# Altium schematic sheet Sheet2.SchDoc
size A4
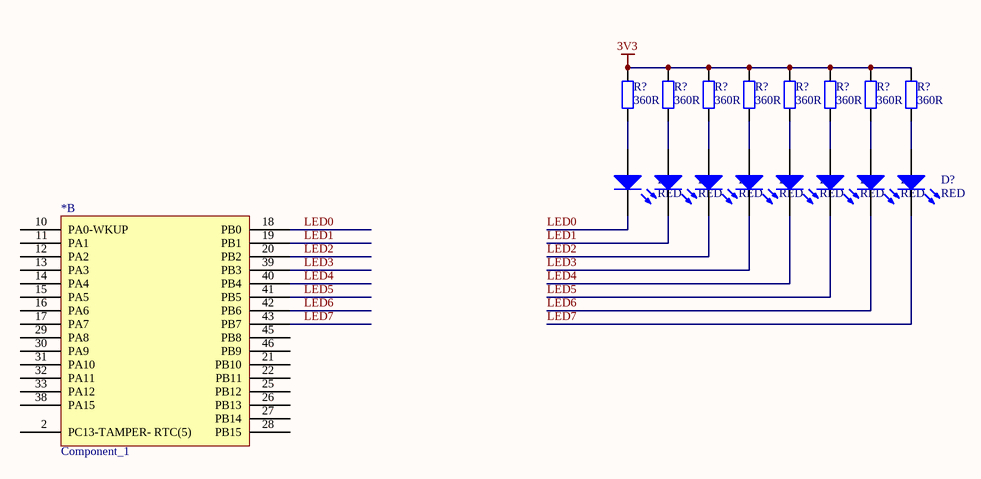
[diagram p0: Sheet2.SchDoc]

## Parts
(Parts that share a designator on the sheet are numbered #1, #2 ... from top to bottom, then left to right.)
*  Component_1  (part B of 2)
D?#1  RED  [LED-0]
D?#2  RED  [LED-0]
D?#3  RED  [LED-0]
D?#4  RED  [LED-0]
D?#5  RED  [LED-0]
D?#6  RED  [LED-0]
D?#7  RED  [LED-0]
D?#8  RED  [LED-0]
R?#1  360R  [AXIAL-0.4]
R?#2  360R  [AXIAL-0.4]
R?#3  360R  [AXIAL-0.4]
R?#4  360R  [AXIAL-0.4]
R?#5  360R  [AXIAL-0.4]
R?#6  360R  [AXIAL-0.4]
R?#7  360R  [AXIAL-0.4]
R?#8  360R  [AXIAL-0.4]

## Nets
3V3: R?#1.2 R?#2.2 R?#3.2 R?#4.2 R?#5.2 R?#6.2 R?#7.2 R?#8.2
LED0: *.18(PB0) D?#1.2(K)
LED1: *.19(PB1) D?#2.2(K)
LED2: *.20(PB2) D?#3.2(K)
LED3: *.39(PB3) D?#4.2(K)
LED4: *.40(PB4) D?#5.2(K)
LED5: *.41(PB5) D?#6.2(K)
LED6: *.42(PB6) D?#7.2(K)
LED7: *.43(PB7) D?#8.2(K)
NetD?#1_1: D?#1.1(A) R?#1.1
NetD?#2_1: D?#2.1(A) R?#2.1
NetD?#3_1: D?#3.1(A) R?#3.1
NetD?#4_1: D?#4.1(A) R?#4.1
NetD?#5_1: D?#5.1(A) R?#5.1
NetD?#6_1: D?#6.1(A) R?#6.1
NetD?#7_1: D?#7.1(A) R?#7.1
NetD?#8_1: D?#8.1(A) R?#8.1

Not connected (* = marked no-connect by the designer): * 2(PC13-TAMPER-_RTC(5)) 10(PA0-WKUP) 11(PA1) 12(PA2) 13(PA3) 14(PA4) 15(PA5) 16(PA6) 17(PA7) 21(PB10) 22(PB11) 25(PB12) 26(PB13) 27(PB14) 28(PB15) 29(PA8) 30(PA9) 31(PA10) 32(PA11) 33(PA12) 38(PA15) 45(PB8) 46(PB9)

## Library data of the parts
D?#1-D?#8 = LED0: Typical INFRARED GaAs LED; Published: 8-Jun-2000; LatestRevisionDate: 08-Jul-2005; LatestRevisionNote: Mech Layer 1 removed.; PackageReference: LED-0; Publisher: Altium Limited; PackageDescription: LED; 2 Leads
R?#1-R?#8 = Res2: Resistor; Value: 1K; Published: 8-Jun-2000; LatestRevisionDate: 17-Jul-2002; LatestRevisionNote: Re-released for DXP Platform.; PackageReference: AXIAL-0.4; Publisher: Altium Limited; PackageDescription: Axial Device, Thru-Hole; 2 Leads; 0.4 in Pin Spacing